# Altium schematic sheet BMS Balancer Indicator.SchDoc
size A4; SheetNumber: 2; SheetTotal: 2
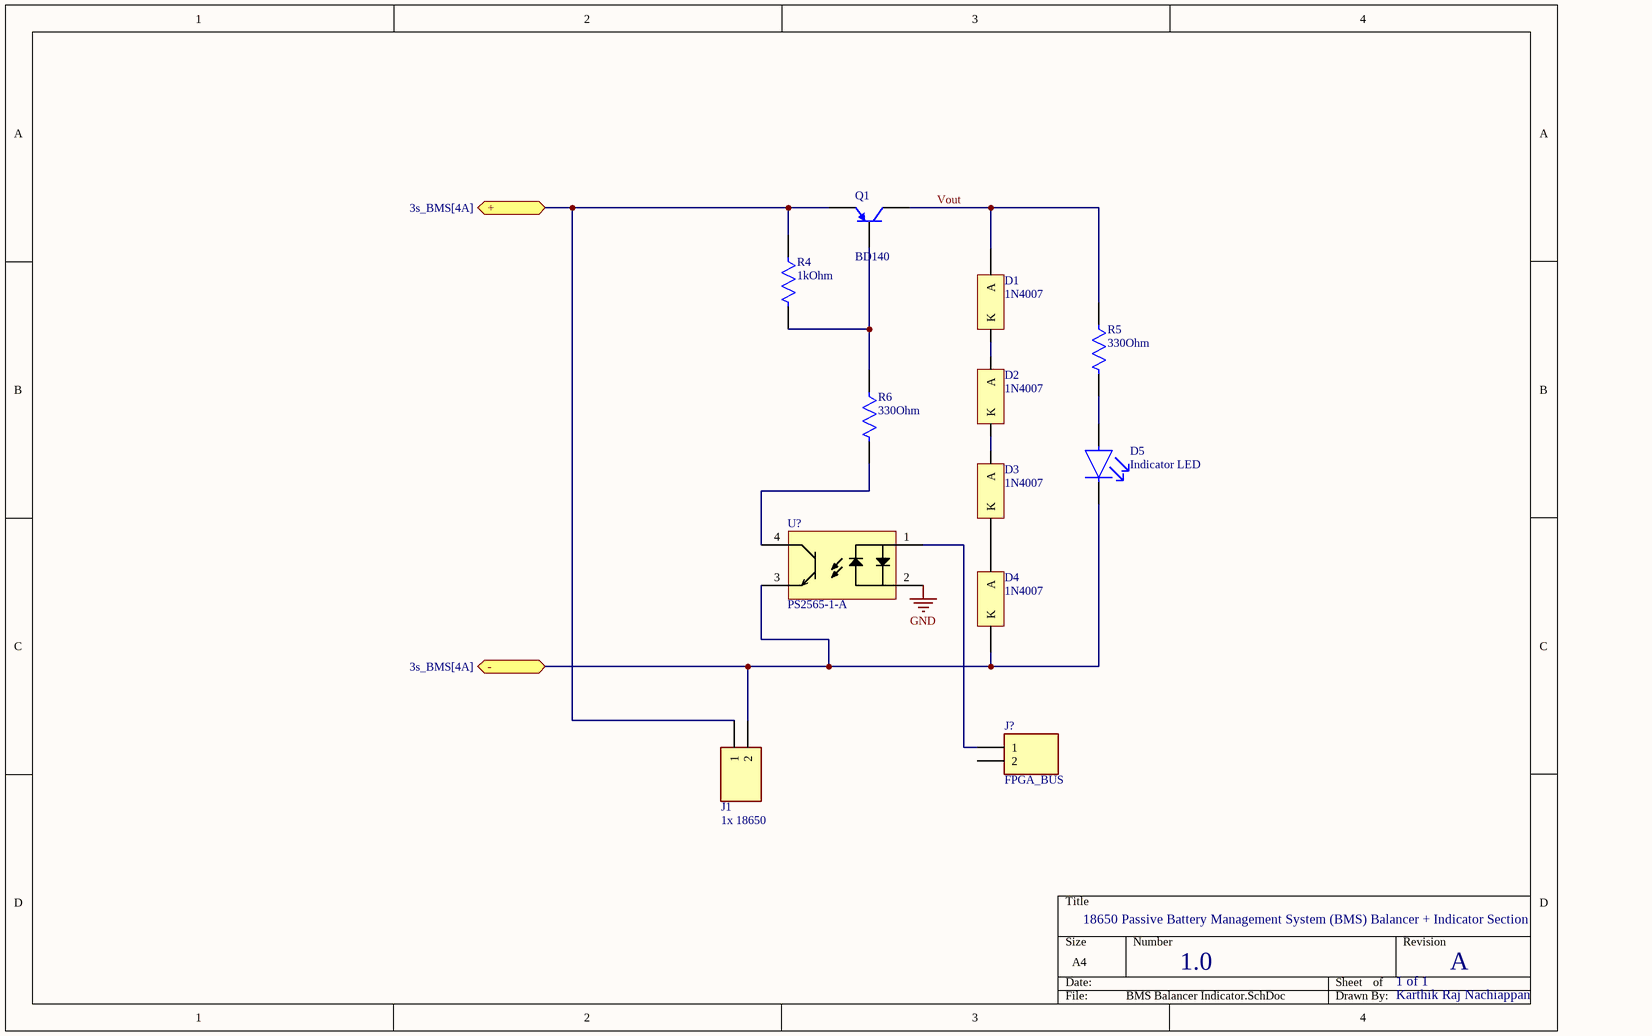
[diagram p0: BMS Balancer Indicator.SchDoc]

## Parts
D1  1N4007  [ONSC-AXIAL_LEAD-2-59-10_P]
D2  1N4007  [ONSC-AXIAL_LEAD-2-59-10_P]
D3  1N4007  [ONSC-AXIAL_LEAD-2-59-10_P]
D4  1N4007  [ONSC-AXIAL_LEAD-2-59-10_P]
D5  Indicator LED  [FP-HLMP-4700-MFG]
J1  1x 18650  [2828372]
J?  FPGA_BUS  [HDRV2W67P0X254_1X2_467X234X823P]
Q1  BD140  [ONSC-TO-225-3-77-09]
R4  1kOhm  [FP-MRS25-MFG]
R5  330Ohm  [FP-MRS25-MFG]
R6  330Ohm  [FP-MRS25-MFG]
U?  PS2565-1-A  [DIP762W50P254L460H455Q4B]

## Ports
+ (bidir, see 3s_BMS[4A]), - (bidir, see 3s_BMS[4A])

## Nets
GND: U?.2(Cathode)
+: J1.1 Q1.1(E) R4.1 ; port +
-: D4.1(K) D5.1(C) J1.2 U?.3(Emitter) ; port -
Vout: D1.2(A) Q1.2(C) R5.1
NetD1_1: D1.1(K) D2.2(A)
NetD2_1: D2.1(K) D3.2(A)
NetD3_1: D3.1(K) D4.2(A)
NetD5_2: D5.2(A) R5.2
NetJ?_1: J?.1 U?.1(Anode)
NetQ1_3: Q1.3(B) R4.2 R6.1
NetR6_2: R6.2 U?.4(Collector)

Not connected (* = marked no-connect by the designer): J? 2

## Notes on the sheet
- 18650 Passive Battery Management System (BMS) Balancer + Indicator Section
- 1.0
- 1 of 1
- A
- Karthik Raj Nachiappan

## Library data of the parts
D1-D4 = CMP-0902-00142-1: Standard Recovery Rectifier, 2-Pin Axial_Lead, Pb-Free, Bulk Bag; Manufacturer: On Semiconductor; IO(rec) Max (A): 1; IFSM Max (A): 30; VRRM Max (V): 1000; ComponentLink3URL: http://www.onsemi.cn/pub_link/Collateral/59-10.PDF; PackageVersion: Rev. U, 02/2005; PackageDescription: 2-Pin, Axial Lead, Diameter 2.35 mm; PackageReference: AXIAL_LEAD-2-59-10; RoHS: TRUE; PartNumber: 1N4007; Packing: Bulk Bag; DatasheetVersion: Rev. 13; ComponentLink3Description: Package Specification; ComponentLink1Description: Manufacturer URL; ComponentLink2URL: http://www.onsemi.com/pub_link/Collateral/1N4001-D.PDF; ComponentLink1URL: http://www.onsemi.com/; Type: Standard Recovery; ComponentLink2Description: Datasheet; Mounting Technology: Through Hole
D5 = CMP-18399-000008-1: LED RED DIFFUSED T-1 3/4 T/H; Manufacturer: Broadcom; Luminous Intensity: 2.3mcd; Peak Emmision Wavelength: 635nm; Forward Voltage: 1.7V; Viewing Angle: 50°; Led Orientation: Straight; Reverse Voltage: 5V; Forward Current: 2mA; Power Dissipation: 14mW; Wavelength: 626nm; Digikey Description: LED RED DIFFUSED T-1 3/4 T/H; Device Class L3: unset; Temperature Range Low: -40°C; Temperature Range High: +100°C; RoHS: TRUE; Package: HLMP-4700; Octopart: https://octopart.com/hlmp-4700-broadcom-71130526; Automotive: No; ComponentLink2URL: https://docs.broadcom.com/docs/AV02-1557EN; Colour: Red; Temperature: -40°C to +100°C; Lead Free: Yes; Category: Diode; ComponentLink2Description: Datasheet; Manufacturer Part Number: HLMP-4700; Device Class L1: Optoelectronics; Device Class L2: LEDs; Mouser Description: LED; Red; 2.3mcd; 0.24In.Dia.; T-1-3/4; 500mA; 1.7V; 635nm; 50deg; 5V; 24mW; -55degC;
J1 = 282837-2: Connector; Manufacturer_Name: TE Connectivity; Datasheet Link: https://www.te.com/commerce/DocumentDelivery/DDEController?Action=srchrtrv&DocNm=282837&DocType=Customer+Drawing&DocLang=English&DocFormat=pdf&PartCntxt=282837-2; Height: 10.3mm; Manufacturer_Part_Number: 282837-2; Mouser Part Number: 571-2828372; Mouser Price/Stock: https://www.mouser.co.uk/ProductDetail/TE-Connectivity/282837-2?qs=A%252Bip%252BNCYi6O2H0NGWOeAxg%3D%3D; Arrow Part Number: 282837-2; Arrow Price/Stock: https://www.arrow.com/en/products/282837-2/te-connectivity?region=europe
J? = 5-146277-2: Connector; Manufacturer_Name: TE Connectivity; Datasheet Link: https://www.te.com/commerce/DocumentDelivery/DDEController?Action=srchrtrv&DocNm=146277&DocType=Customer+Drawing&DocLang=English; Height: 8.23mm; Manufacturer_Part_Number: 5-146277-2; Mouser Part Number: 571-5-146277-2; Mouser Price/Stock: https://www.mouser.co.uk/ProductDetail/TE-Connectivity/5-146277-2?qs=bwpFY26eRVdSYoepUea0uA%3D%3D; Arrow Part Number: 5-146277-2; Arrow Price/Stock: https://www.arrow.com/en/products/5-146277-2/te-connectivity?region=nac
Q1 = CMP-1048-00039-1: Plastic Medium-Power Silicon PNP Transistor, 3-Pin TO-225, Bulk Box; Manufacturer: On Semiconductor; IC Continuous (A): 1.5; PartNumber: BD140; ComponentLink1Description: Manufacturer URL; RoHS: FALSE; ComponentLink1URL: http://www.onsemi.com/; DatasheetVersion: Rev. 15; ComponentLink2URL: http://www.onsemi.com/pub_link/Collateral/BD136-D.PDF; ComponentLink3Description: Package Specification; Packing: Bulk Box; PackageVersion: Rev. AC, 12/2013; ComponentLink3URL: http://www.onsemi.com/pub_link/Collateral/77-09.PDF; PackageDescription: 3-Pin Flange Mount, Vertical Straight Lead, Body 7.6 x 2.7 mm, Pitch 2.29 mm; Mounting Technology: Through Hole; PackageReference: TO-225-3-77-09; ComponentLink2Description: Datasheet; Polarity: PNP
R4-R6 = CMP-02408-000051-1: RES 1K OHM 0.6W 1% AXIAL; Power Rating: 600mW; Lead Diameter: 0.6mm; Voltage Rating (DC): 350V; Resistance: 1kR; Temperature Coefficient: 50ppm/°C; Width: 2.5mm; Military Standard: Not; Package Quantity: 5000; Radiation Hardening: No; Case/Package: Axial; Resistance Tolerance: 1%; Resistor Type: Metal Film; Contact Plating: Tin; Length: 6.5mm; Lead Free: Lead Free; RoHS Compliant: Yes; Mount: Through Hole; Number of Pins: 2; Technology: THIN FILM; Voltage Rating: 350V; Min Operating Temperature: -55°C; Weight: 0.00776oz; Diameter: 2.5mm; Construction: Cylindrical; Series: MRS25; Tolerance: 1%; Packaging: Tape and Reel; Max Operating Temperature: 155°C; Max Power Dissipation: 600mW; Number of Terminations: 2; Termination: Axial
U? = CMP-00572-25674254-1: PS2565-1-A Optocoupler AC-IN 1-CH Transistor DC-OUT 4-Pin PDIP Magazine; Number of Elements: 1; Isolation Voltage: 5kV; Collector Emitter Voltage (VCEO): 300mV; Forward Current: 80mA; Output Current per Channel: 50mA; Output Voltage: 80V; Current Transfer Ratio: 400%; Forward Voltage: 1.4V; Rise Time: 3µs; Max Power Dissipation: 150mW; RoHS: Compliant; Radiation Hardening: No; Case/Package: DIP; Mount: Through Hole; Number of Pins: 4; Number of Channels: 1; Min Operating Temperature: -55°C; Max Collector Current: 50mA; Number of Circuits: 1; Collector Emitter Saturation Voltage: 300mV; Max Input Current: 80mA; Lead Free: Lead Free; NexarPartId: 25674254; Power Dissipation: 150mW; Max Operating Temperature: 100°C